# EasyEDA Pro project all_pcb.eprj

# Schematic Schematic1
Board Name: 前置差分放大; Create Date: 2024-09-15
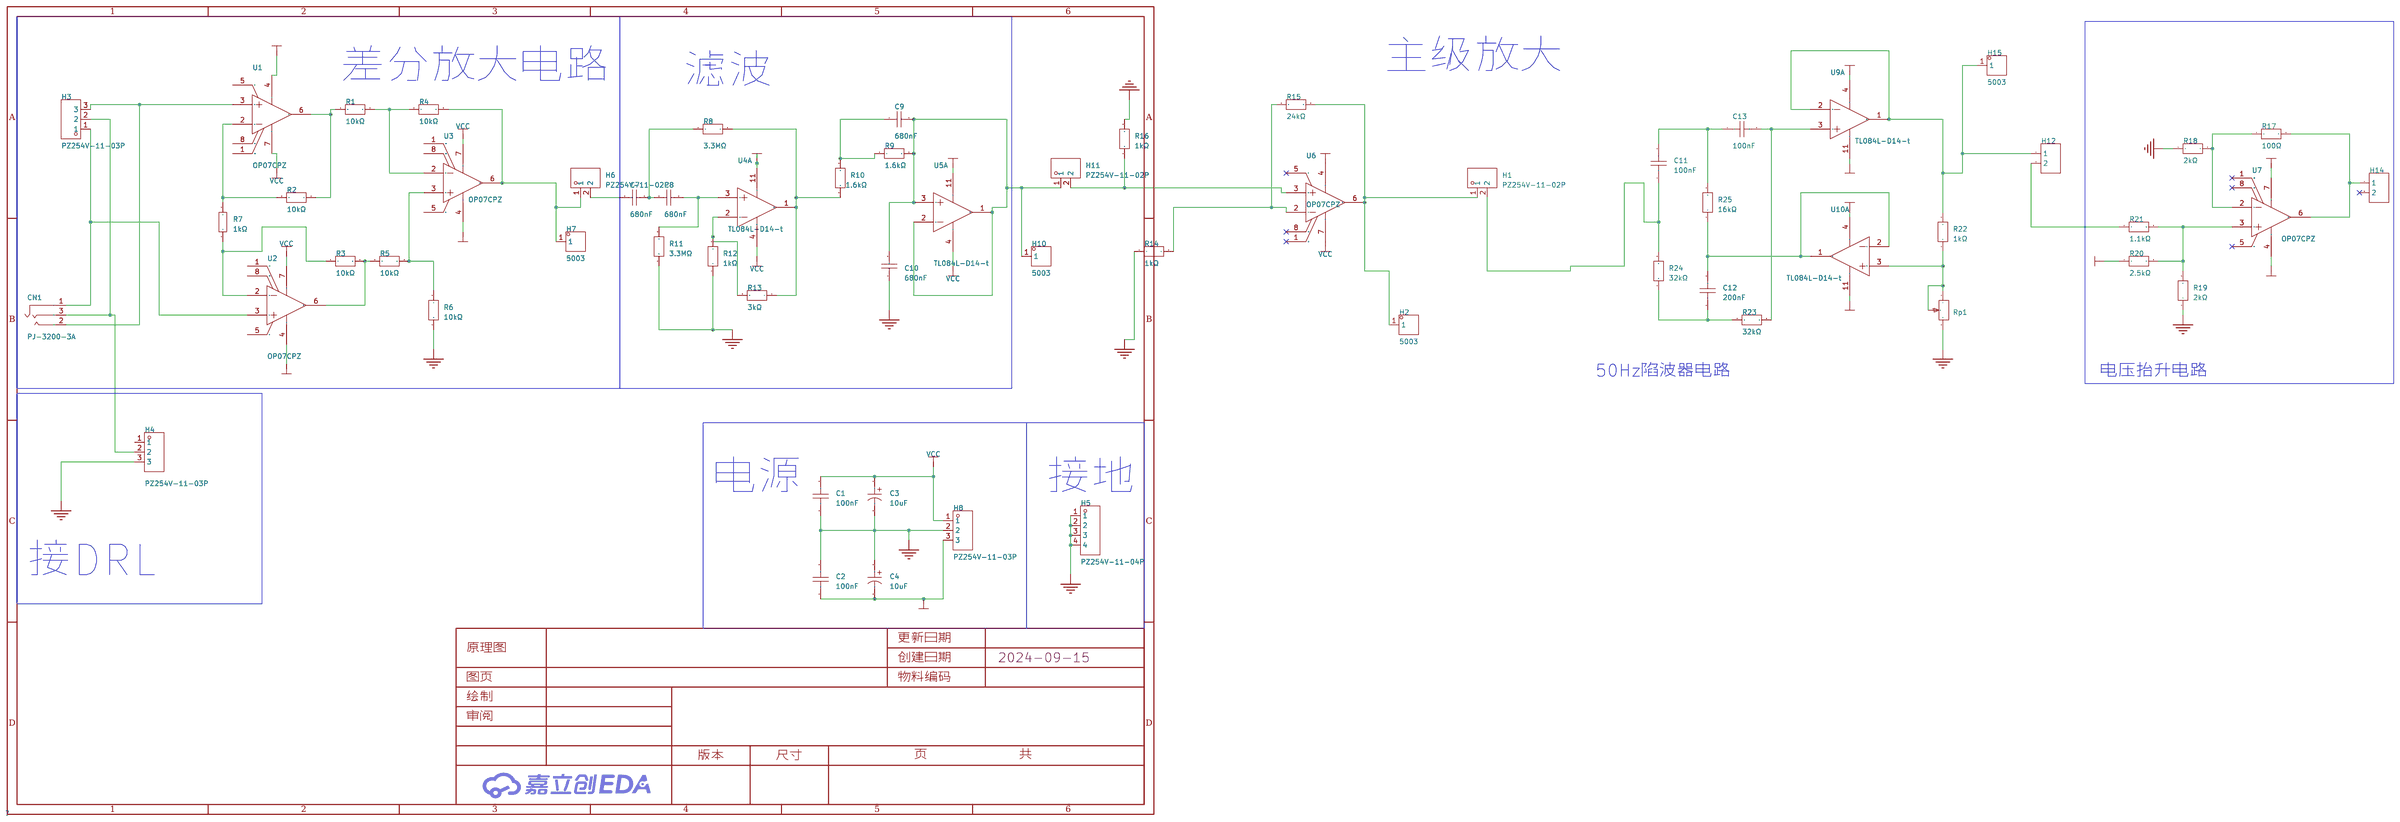
[diagram p0: schematic sheet]

## Parts
C1  100nF  [CAP-TH_L13.0-W6.0-P10.0-D0.6]
C2  100nF  [CAP-TH_L13.0-W6.0-P10.0-D0.6]
C3  10uF  [CAP-TH_BD10.0-P5.00-D0.6-FD]
C4  10uF  [CAP-TH_BD10.0-P5.00-D0.6-FD]
C7  680nF  [CAP-TH_L7.5-W6.5-P5.00-D0.5]
C8  680nF  [CAP-TH_L7.5-W6.5-P5.00-D0.5]
C9  680nF  [CAP-TH_L7.5-W6.5-P5.00-D0.5]
C10  680nF  [CAP-TH_L7.5-W6.5-P5.00-D0.5]
C11  100nF  [CAP-TH_L5.1-W3.8-P5.08-D1.2]
C12  200nF  [CAP-TH_L18.0-W8.0-P15.00-D0.8]
C13  100nF  [CAP-TH_L5.1-W3.8-P5.08-D1.2]
CN1  PJ-3200-3A  [AUDIO-TH_PJ-3200-3A]
H1  PZ254V-11-02P  [HDR-TH_2P-P2.54-V-M]
H2  5003  [TEST-TH_BD2.54-P1.39]
H3  PZ254V-11-03P  [HDR-TH_3P-P2.54-V-M]
H4  PZ254V-11-03P  [HDR-TH_3P-P2.54-V-M]
H5  PZ254V-11-04P  [HDR-TH_4P-P2.54-V-M]
H6  PZ254V-11-02P  [HDR-TH_2P-P2.54-V-M]
H7  5003  [TEST-TH_BD2.54-P1.39]
H8  PZ254V-11-03P  [HDR-TH_3P-P2.54-V-M]
H10  5003  [TEST-TH_BD2.54-P1.39]
H11  PZ254V-11-02P  [HDR-TH_2P-P2.54-V-M]
H12  -  [HDR-TH_2P-P2.54-V-F]
H14  -  [HDR-TH_2P-P2.54-V-F]
H15  5003  [TEST-TH_BD2.54-P1.39]
R1  10kΩ  [RES-TH_BD2.4-L6.3-P10.30-D0.6]
R2  10kΩ  [RES-TH_BD2.4-L6.3-P10.30-D0.6]
R3  10kΩ  [RES-TH_BD2.4-L6.3-P10.30-D0.6]
R4  10kΩ  [RES-TH_BD2.4-L6.3-P10.30-D0.6]
R5  10kΩ  [RES-TH_BD2.4-L6.3-P10.30-D0.6]
R6  10kΩ  [RES-TH_BD2.4-L6.3-P10.30-D0.6]
R7  1kΩ  [RES-TH_BD2.5-L6.5-P10.50-D0.6]
R8  3.3MΩ  [RES-TH_BD2.4-L6.3-P10.30-D0.6]
R9  1.6kΩ  [RES-TH_BD2.4-L6.3-P10.30-D0.6]
R10  1.6kΩ  [RES-TH_BD2.4-L6.3-P10.30-D0.6]
R11  3.3MΩ  [RES-TH_BD2.4-L6.3-P10.30-D0.6]
R12  1kΩ  [RES-TH_BD2.4-L6.3-P10.30-D0.6]
R13  3kΩ  [RES-TH_BD2.4-L6.3-P10.30-D0.6]
R14  1kΩ  [RES-TH_BD2.4-L6.3-P10.30-D0.6]
R15  24kΩ  [RES-TH_BD2.4-L6.3-P10.30-D0.6]
R16  1kΩ  [RES-TH_BD2.4-L6.3-P10.30-D0.6]
R17  100Ω  [RES-TH_BD3.7-L10.0-P15.00-D0.6]
R18  2kΩ  [RES-TH_BD2.3-L6.5-P10.50-D0.5]
R19  2kΩ  [RES-TH_BD2.3-L6.5-P10.50-D0.5]
R20  2.5kΩ  [RES-TH_BD4.6-L11.4-P15.40-D0.8]
R21  1.1kΩ  [RES-TH_BD3.3-L9.0-P13.00-D0.6]
R22  1kΩ  [RES-TH_BD2.3-L6.5-P10.50-D0.5]
R23  32kΩ  [RES-TH_BD2.4-L6.5-P10.50-D0.5]
R24  32kΩ  [RES-TH_BD2.4-L6.5-P10.50-D0.5]
R25  16kΩ  [RES-TH_BD3.3-L9.0-P13.00-D0.6]
Rp1  -  [RES-ADJ-TH_3296W]
U1  OP07CPZ  [PDIP-8_L9.3-W6.4-P2.54-LS7.6-BL]
U2  OP07CPZ  [PDIP-8_L9.3-W6.4-P2.54-LS7.6-BL]
U3  OP07CPZ  [PDIP-8_L9.3-W6.4-P2.54-LS7.6-BL]
U4  TL084L-D14-t  [PDIP-14_L19.3-W6.5-P2.54-LS7.6-BL]  (section 1)
U5  TL084L-D14-t  [PDIP-14_L19.3-W6.5-P2.54-LS7.6-BL]  (section 1)
U6  OP07CPZ  [PDIP-8_L9.3-W6.4-P2.54-LS7.6-BL]
U7  OP07CPZ  [PDIP-8_L9.3-W6.4-P2.54-LS7.6-BL]
U9  TL084L-D14-t  [PDIP-14_L19.3-W6.5-P2.54-LS7.6-BL]  (section 1)
U10  TL084L-D14-t  [PDIP-14_L19.3-W6.5-P2.54-LS7.6-BL]  (section 1)

## Library data of the parts
C1 C2 = 1X2H410K275-11: LCSC Part Name: 等级:X2 100nF ±10% 275V; Supplier Part: C2846731; Manufacturer: BM(丰明电容); Supplier Footprint: 插件,P=10mm; JLCPCB Part Class: 扩展库; Datasheet: https://atta.szlcsc.com/upload/public/pdf/source/20210728/C2846732_DAC16FCBF90FAF4BF667A23B36E0C6E8.pdf; Supplier: LCSC; Tolerance: ±10%; Voltage(AC): 275V; Subclass: X2
C3 C4 = UCS2E100MPD1TD: LCSC Part Name: 10uF ±20% 250V; Supplier Part: C1579721; Manufacturer: Nichicon(尼吉康); Supplier Footprint: 插件; JLCPCB Part Class: 扩展库; Datasheet: https://atta.szlcsc.com/upload/public/pdf/source/20211009/4F4CA769B8C92F768087E64A1413DB40.pdf; Supplier: LCSC; Tolerance: ±20%; Rated Voltage: 250V; Ripple Current: 175mA@120Hz; Lead Spacing: 5mm; φD: 10mm; Lifetime @ Temp: 8000hrs@105℃; Operating Temperature: -40℃~+105℃
C7-C10 = PE684J2A0502: 容值:680nF;精度:±5%;额定电压:100V;工作温度:-40℃~+110℃;; LCSC Part Name: 680nF ±5% 100V; Supplier Part: C478437; Manufacturer: KYET(科雅); Supplier Footprint: 插件,P=5mm; JLCPCB Part Class: 扩展库; Datasheet: https://atta.szlcsc.com/upload/public/pdf/source/20200102/C478437_80764A5A52068CAA3BEDED5BEA089104.pdf; Supplier: LCSC; Tolerance: ±5%; Voltage Rated: 100V; Operating Temperature: -40℃~+110℃
C11 C13 = C322C104KBR5TA: 容值:100nF;精度:±10%;额定电压:630V;温度系数:X7R;; LCSC Part Name: 100nF ±10% 630V; Supplier Part: C129685; Manufacturer: KEMET(基美); Supplier Footprint: 插件,P=5.08mm; JLCPCB Part Class: 扩展库; Datasheet: https://atta.szlcsc.com/upload/public/pdf/source/20180502/C129685_22A0E9A1A89AC8F69AAACD1F3AA6AB03.pdf; Supplier: LCSC; Tolerance: ±10%; Voltage Rated: 630V; Temperature Coefficient: X7R
C12 = B32922H3204M: 容值:200nF;精度:±20%;电压(AC):305V;等级:X2;; LCSC Part Name: 等级:X2 200nF ±20% 305V; Supplier Part: C3298878; Manufacturer: TDK; Supplier Footprint: 插件,P=15mm; JLCPCB Part Class: 扩展库; Datasheet: https://atta.szlcsc.com/upload/public/pdf/source/20240403/6B857094AE2B4215483F52CB5BD16209.pdf; Supplier: LCSC; Tolerance: ±20%; Voltage(AC): 305V; Subclass: X2; Operating Temperature: -40℃~+110℃
CN1 = PJ-3200-3A: LCSC Part Name: 3.5mm耳机座; Supplier Part: C709202; Manufacturer: 韩国韩荣; Supplier Footprint: 插件; JLCPCB Part Class: 扩展库; Datasheet: https://atta.szlcsc.com/upload/public/pdf/source/20201012/C709202_4DD47C61DF91E6337EB1570AC409C882.pdf; Supplier: LCSC; Connector Type: 3.5mm耳机座; Current Rating (Max): 500mA; Voltage Rating (Max): 30V; Operating Temperature Range: -20℃~+70℃
H1 H6 H11 = PZ254V-11-02P: LCSC Part Name: 间距:2.54mm 1x2P 直插 方针; Supplier Part: C492401; Manufacturer: XFCN(兴飞); Supplier Footprint: 插件,P=2.54mm; JLCPCB Part Class: 扩展库; Datasheet: https://atta.szlcsc.com/upload/public/pdf/source/20200309/C492401_A812433581A9B211A7FFA413ADDFF0E5.pdf; Supplier: LCSC; Pin Structure: 1x2P; Pitch: 2.54mm; Circluar Pins/Square Pins: 方针; Mounting Type: 直插; Number of Rows: 单排; Number of Pins: 2P; Length of Mating Pin: 6mm; Insulation Height: 2.5mm; Length of End Connection Pin: 3mm; Contact Material: 黄铜; Operating Temperature Range: -40℃~+105℃; Color: 黑色
H2 H7 H10 H15 = 5003: Supplier Part: C238124; Manufacturer: Keystone; Datasheet: https://atta.szlcsc.com/upload/public/pdf/source/20211115/64B944F8418AA2CF0680BB1B201435FB.pdf; Supplier: LCSC; Type: 测试环; Overall Length/Height: 7.62mm; Contact Material: 磷青铜
H3 H4 H8 = PZ254V-11-03P: LCSC Part Name: 间距:2.54mm 1x3P 直插 方针; Supplier Part: C2937625; Manufacturer: XFCN(兴飞); Supplier Footprint: 插件,P=2.54mm; JLCPCB Part Class: 扩展库; Datasheet: https://atta.szlcsc.com/upload/public/pdf/source/20200309/C492402_8335C3D49C4E4C618838D59BB1D024C1.pdf; Supplier: LCSC; Pin Structure: 1x3P; Pitch: 2.54mm; Circluar Pins/Square Pins: 方针; Mounting Type: 直插; Number of Rows: 单排; Number of Pins: 3P; Current Rating (Max): 3A; Voltage Rating (Max): 250V; Length of Mating Pin: 6mm; Insulation Height: 2.5mm; Length of End Connection Pin: 3mm; Operating Temperature Range: -40℃~+105℃; Color: 黑色
H5 = PZ254V-11-04P: LCSC Part Name: 间距:2.54mm 1x4P 直插 方针; Supplier Part: C2691448; Manufacturer: XFCN(兴飞); Supplier Footprint: 插件,P=2.54mm; JLCPCB Part Class: 扩展库; Datasheet: https://atta.szlcsc.com/upload/public/pdf/source/20200309/C492403_F9F19131791D08044AD4F84F8E751A34.pdf; Supplier: LCSC; Pin Structure: 1x4P; Pitch: 2.54mm; Circluar Pins/Square Pins: 方针; Mounting Type: 直插; Number of Rows: 单排; Number of Pins: 4P; Current Rating (Max): 3A; Voltage Rating (Max): 250V; Length of Mating Pin: 6mm; Insulation Height: 2.5mm; Length of End Connection Pin: 3mm; Operating Temperature Range: -40℃~+105℃; Color: 黑色
H12 H14 = HDR-F_2.54_1x2P: Supplier Part: C49661; Supplier Footprint: 插件
R1-R6 R8-R16 = RN1/4W10KFT/BA1: LCSC Part Name: 10kΩ ±1% 250mW 金属膜电阻; Supplier Part: C410695; Manufacturer: Tyohm(幸亚电阻); Supplier Footprint: 插件,D2.4xL6.5mm; JLCPCB Part Class: 扩展库; Datasheet: https://atta.szlcsc.com/upload/public/pdf/source/20190808/C410699_D126E64D28B638F1D73B58E9F61DFD9B.pdf; Supplier: LCSC; Type: 金属膜电阻; Tolerance: ±1%; Overload Voltage (Max): 250V; Power(Watts): 250mW; Temperature Coefficient: ±50ppm/℃; Operating Temperature Range: -55℃~+125℃
R7 = MFR0W4F1001A50: LCSC Part Name: 1kΩ ±1% 250mW 金属膜电阻; Supplier Part: C57435; Manufacturer: UNI-ROYAL(厚声); Supplier Footprint: 插件,D2.2xL6.5mm; JLCPCB Part Class: 扩展库; Datasheet: https://atta.szlcsc.com/upload/public/pdf/source/20191012/C436293_8820AA14BC71FA35E551C06C441482A0.pdf; Supplier: LCSC; Type: 金属膜电阻; Tolerance: ±1%; Overload Voltage (Max): 250V; Power(Watts): 250mW; Temperature Coefficient: ±50ppm/℃
R17 = MMFR3710B100RV9: 电阻类型:金属膜电阻;阻值:100Ω;精度:±0.1%;功率:500mW;温度系数:±5ppm/℃;; LCSC Part Name: 金属膜电阻 100Ω ±0.1% 500mW; Supplier Part: C7603277; Manufacturer: RESI(开步睿思); Supplier Footprint: 插件,D3.7xL10mm; Datasheet: https://atta.szlcsc.com/upload/public/pdf/source/20230906/5CDEB36B20538353A7DCF0119D7D7003.pdf; Supplier: LCSC; Type: 金属膜电阻; Tolerance: ±0.1%; Overload Voltage (Max): 300V; Power(Watts): 500mW; Temperature Coefficient: ±5ppm/℃; Operating Temperature Range: -55℃~+125℃
R18 R19 = MF1/4W-2KΩ±1%T52: 电阻类型:金属膜电阻;阻值:2kΩ;精度:±1%;功率:250mW;温度系数:±200ppm/℃;; LCSC Part Name: 金属膜电阻 2kΩ ±1% 250mW; Supplier Part: C714001; Manufacturer: 华星机电; Supplier Footprint: 插件,D2.3xL6.5mm; JLCPCB Part Class: 扩展库; Datasheet: https://atta.szlcsc.com/upload/public/pdf/source/20200731/C713882_AE8EB1102749D7E4FB4FB13DC898C429.pdf; Supplier: LCSC; Type: 金属膜电阻; Tolerance: ±1%; Power(Watts): 250mW; Temperature Coefficient: ±200ppm/℃
R20 = WHC2K5FET: 电阻类型:绕线电阻;阻值:2.5kΩ;精度:±1%;功率:2W;温度系数:±20ppm/℃;; LCSC Part Name: 绕线电阻 2.5kΩ ±1% 2W; Supplier Part: C3505401; Manufacturer: Ohmite; Supplier Footprint: 插件,D4.6xL11.4mm; JLCPCB Part Class: 扩展库; Datasheet: https://atta.szlcsc.com/upload/public/pdf/source/20210417/087EAD1F647A2CF587132FB7AFBF5B0A.pdf; Supplier: LCSC; Type: 绕线电阻; Tolerance: ±1%; Power(Watts): 2W; Temperature Coefficient: ±20ppm/℃; Operating Temperature Range: -55℃~+150℃
R21 = RSF-50JR-52-1K1: 电阻类型:金属膜电阻;阻值:1.1kΩ;精度:±5%;功率:500mW;温度系数:±300ppm/℃;; LCSC Part Name: 金属膜电阻 1.1kΩ ±5% 500mW; Supplier Part: C1752465; Manufacturer: YAGEO(国巨); Supplier Footprint: 插件,D3.3xL9mm; JLCPCB Part Class: 扩展库; Datasheet: https://atta.szlcsc.com/upload/public/pdf/source/20200722/C705062_59B157870D59CA0881ABA296A8644ADF.pdf; Supplier: LCSC; Type: 金属膜电阻; Tolerance: ±5%; Power(Watts): 500mW; Temperature Coefficient: ±300ppm/℃; Operating Temperature Range: -55℃~+155℃
R22 = MF1/4W-5.1KΩ±1%T52: 电阻类型:金属膜电阻;阻值:5.1kΩ;精度:±1%;功率:250mW;温度系数:±200ppm/℃;; LCSC Part Name: 金属膜电阻 5.1kΩ ±1% 250mW; Supplier Part: C714010; Manufacturer: 华星机电; Supplier Footprint: 插件,D2.3xL6.5mm; Datasheet: https://atta.szlcsc.com/upload/public/pdf/source/20200731/C713882_AE8EB1102749D7E4FB4FB13DC898C429.pdf; Supplier: LCSC; Type: 金属膜电阻; Tolerance: ±1%; Power(Watts): 250mW; Temperature Coefficient: ±200ppm/℃
R23 R24 = RNF14BTE32K0: 电阻类型:金属膜电阻;阻值:32kΩ;精度:±0.1%;功率:250mW;温度系数:±25ppm/℃;; LCSC Part Name: 金属膜电阻 32kΩ ±0.1% 250mW; Supplier Part: C2592661; Manufacturer: SEI(Stackpole Electronics Inc.); Supplier Footprint: 插件,D2.4xL6.4mm; JLCPCB Part Class: 扩展库; Datasheet: https://atta.szlcsc.com/upload/public/pdf/source/20210416/CE3C3DFE1F0E2A8D22EC743938724C43.pdf; Supplier: LCSC; Type: 金属膜电阻; Tolerance: ±0.1%; Power(Watts): 250mW; Temperature Coefficient: ±25ppm/℃; Operating Temperature Range: -55℃~+155℃
R25 = RSF-50JT-52-16K: 电阻类型:金属膜电阻;阻值:16kΩ;精度:±5%;功率:500mW;温度系数:±300ppm/℃;; LCSC Part Name: 金属膜电阻 16kΩ ±5% 500mW; Supplier Part: C1377696; Manufacturer: YAGEO(国巨); Supplier Footprint: 插件,D3.3xL9mm; JLCPCB Part Class: 扩展库; Datasheet: https://atta.szlcsc.com/upload/public/pdf/source/20200722/C705062_59B157870D59CA0881ABA296A8644ADF.pdf; Supplier: LCSC; Type: 金属膜电阻; Tolerance: ±5%; Power(Watts): 500mW; Temperature Coefficient: ±300ppm/℃; Operating Temperature Range: -55℃~+155℃
Rp1 = 精密电位器 3296W/50欧姆: 阻值:-;功率:-;; LCSC Part Name: 50Ω; Supplier Part: C21881; Supplier Footprint: VR-3296W; JLCPCB Part Class: 扩展库; Supplier: LCSC
U1-U3 U6 U7 = OP07CPZ: Supplier Part: C408829; Manufacturer: ADI(亚德诺); Supplier Footprint: PDIP-8; JLCPCB Part Class: 扩展库; Datasheet: https://atta.szlcsc.com/upload/public/pdf/source/20190807/C408829_BE0F3A08CC30F779D7ED20D5AC7364F9.pdf; Supplier: LCSC
U4 U5 U9 U10 = TL084L-D14-t: Supplier Part: C7509603; Manufacturer: UTC(友顺); Supplier Footprint: DIP-14; JLCPCB Part Class: 扩展库; Datasheet: https://atta.szlcsc.com/upload/public/pdf/source/20230825/21103CE5C41335A2FDBC1DDE797A8A69.pdf; Supplier: LCSC

## Nets
GND: C1.1 C2.2 C3.2 C4.1 C10.1 H4.3 H5.1 H5.2 H5.3 H5.4 H8.2 R6.1 R11.1 R12.1 R14.1 R16.2 R18.1 R19.1 Rp1.3
VCC: C1.2 C3.1 H8.1 R20.1 U1.7(V+) U2.7(V+) U3.7(V+) U4.4(V+) U5.4(V+) U6.7(V+) U7.7(V+) U9.4(V+) U10.4(V+)
VEE: C2.1 C4.2 H8.3 U1.4(V-) U2.4(V-) U3.4(V-) U4.11(V-) U5.11(V-) U6.4(V-) U7.4(V-) U9.11(V-) U10.11(V-)
$1N1148: CN1.2 H3.3 U1.3(IN+)
$1N1174: R3.1 R7.1 U2.2(IN-)
$1N1182: CN1.1 H3.1 U2.3(IN+)
$1N1311: R2.2 R7.2 U1.2(IN-)
$1N1319: R1.1 R2.1 U1.6(OUT)
$1N1379: R3.2 R5.1 U2.6(OUT)
$1N1397: R1.2 R4.1 U3.2(IN-)
$1N1420: R5.2 R6.2 U3.3(IN+)
$1N1452: H6.1 H7.1 R4.2 U3.6(OUT)
$1N2211: CN1.3 H3.2 H4.2
$1N4885: C7.2 C8.1 R8.1
$1N4886: C8.2 R11.2 U4.3(IN1+)
$1N4888: R12.2 R13.2 U4.2(IN1-)
$1N4890: R8.2 R10.1 R13.1 U4.1(OUT1)
$1N4893: C9.1 R9.1 R10.2
$1N5273: C7.1 H6.2
$1N6829: R14.2 R15.1 U6.2(IN-)
$1N6834: H11.2 R16.1 U6.3(IN+)
$1N8038: H1.1 H2.1 R15.2 U6.6(OUT)
$1N8751: C11.1 H1.2 R24.2
$1N9817: R22.1 Rp1.1 Rp1.2 U10.3(IN1+)
$1N9823: C12.2 R25.1 U10.1(OUT1) U10.2(IN1-)
$1N9824: H12.1 H15.1 R22.2 U9.1(OUT1) U9.2(IN1-)
$1N9825: C13.2 R23.2 U9.3(IN1+)
$1N9827: C12.1 R23.1 R24.1
$1N9828: C11.2 C13.1 R25.2
$1N9831: R19.2 R20.2 R21.2 U7.3(IN+)
$1N9832: H12.2 R21.1
$1N9836: R17.1 R18.2 U7.2(IN-)
$1N9837: H14.1 R17.2 U7.6(OUT)
$1N15205: C9.2 C10.2 H10.1 H11.1 R9.2 U5.1(OUT1) U5.2(IN1-) U5.3(IN1+)

Not connected (* = marked no-connect by the designer): H4 1; H14 2*; U1 1(VOS_TRIM) 5(NC) 8(VOS_TRIM); U2 1(VOS_TRIM) 5(NC) 8(VOS_TRIM); U3 1(VOS_TRIM) 5(NC) 8(VOS_TRIM); U6 1(VOS_TRIM)* 5(NC)* 8(VOS_TRIM)*; U7 1(VOS_TRIM)* 5(NC)* 8(VOS_TRIM)*

## Notes on the sheet
- 主级放大
- 差分放大电路
- 滤波
- 50Hz陷波器电路
- 电压抬升电路
- 电源
- 接地
- 接DRL

# Board PCB1
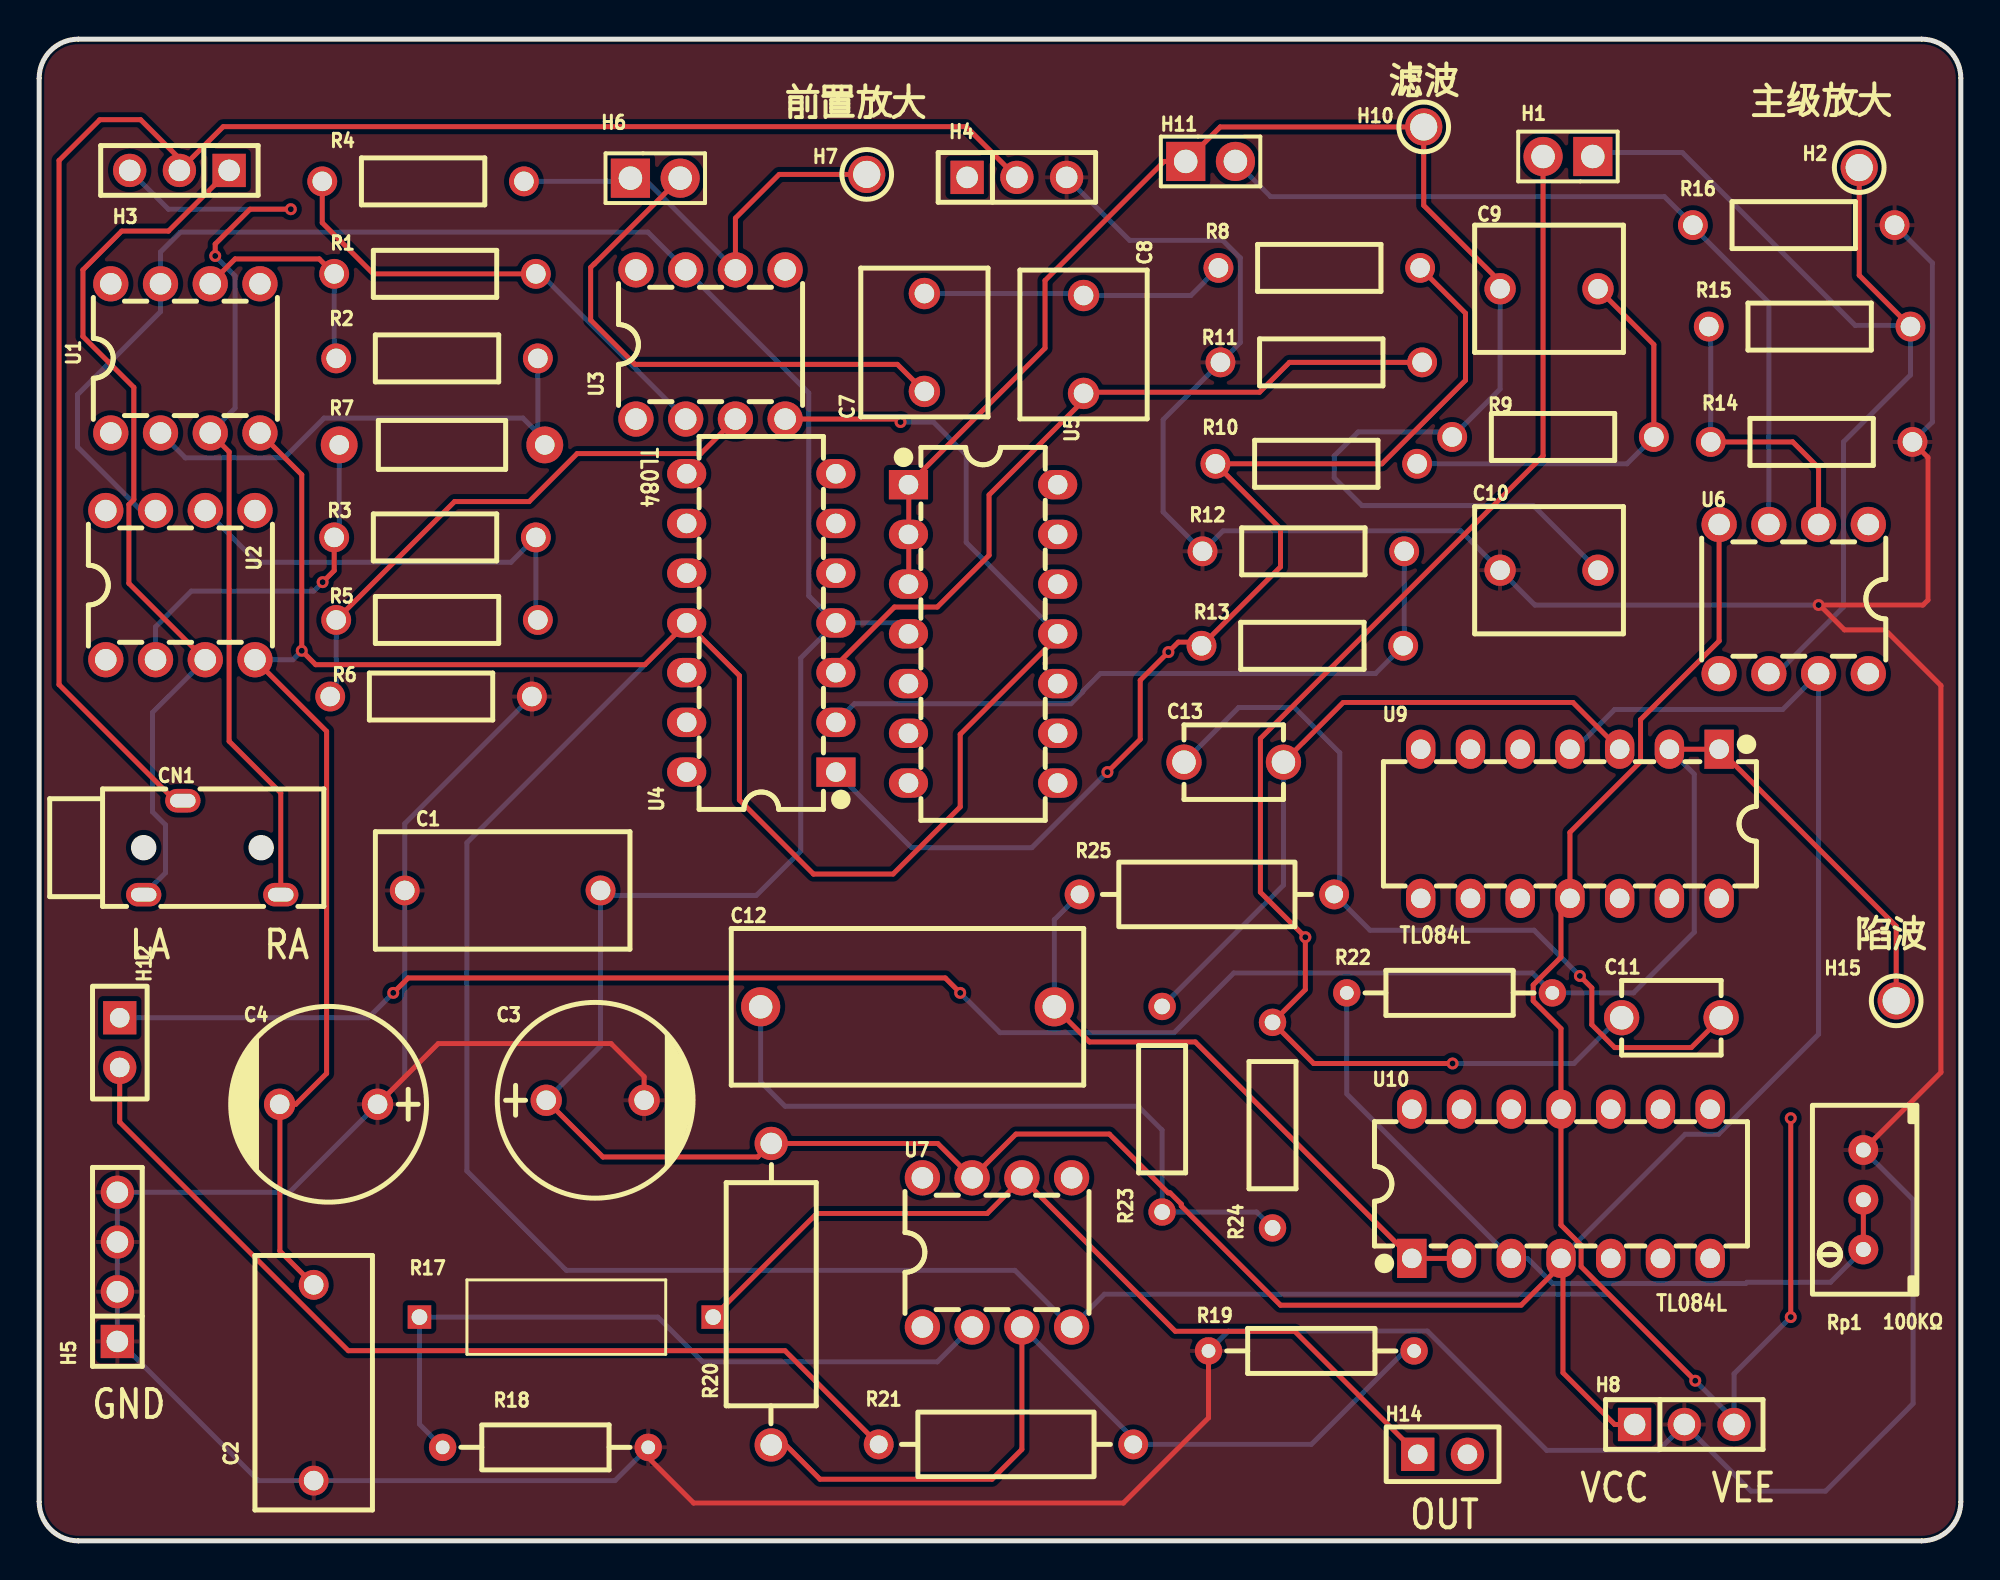
[diagram p1: board, top side]
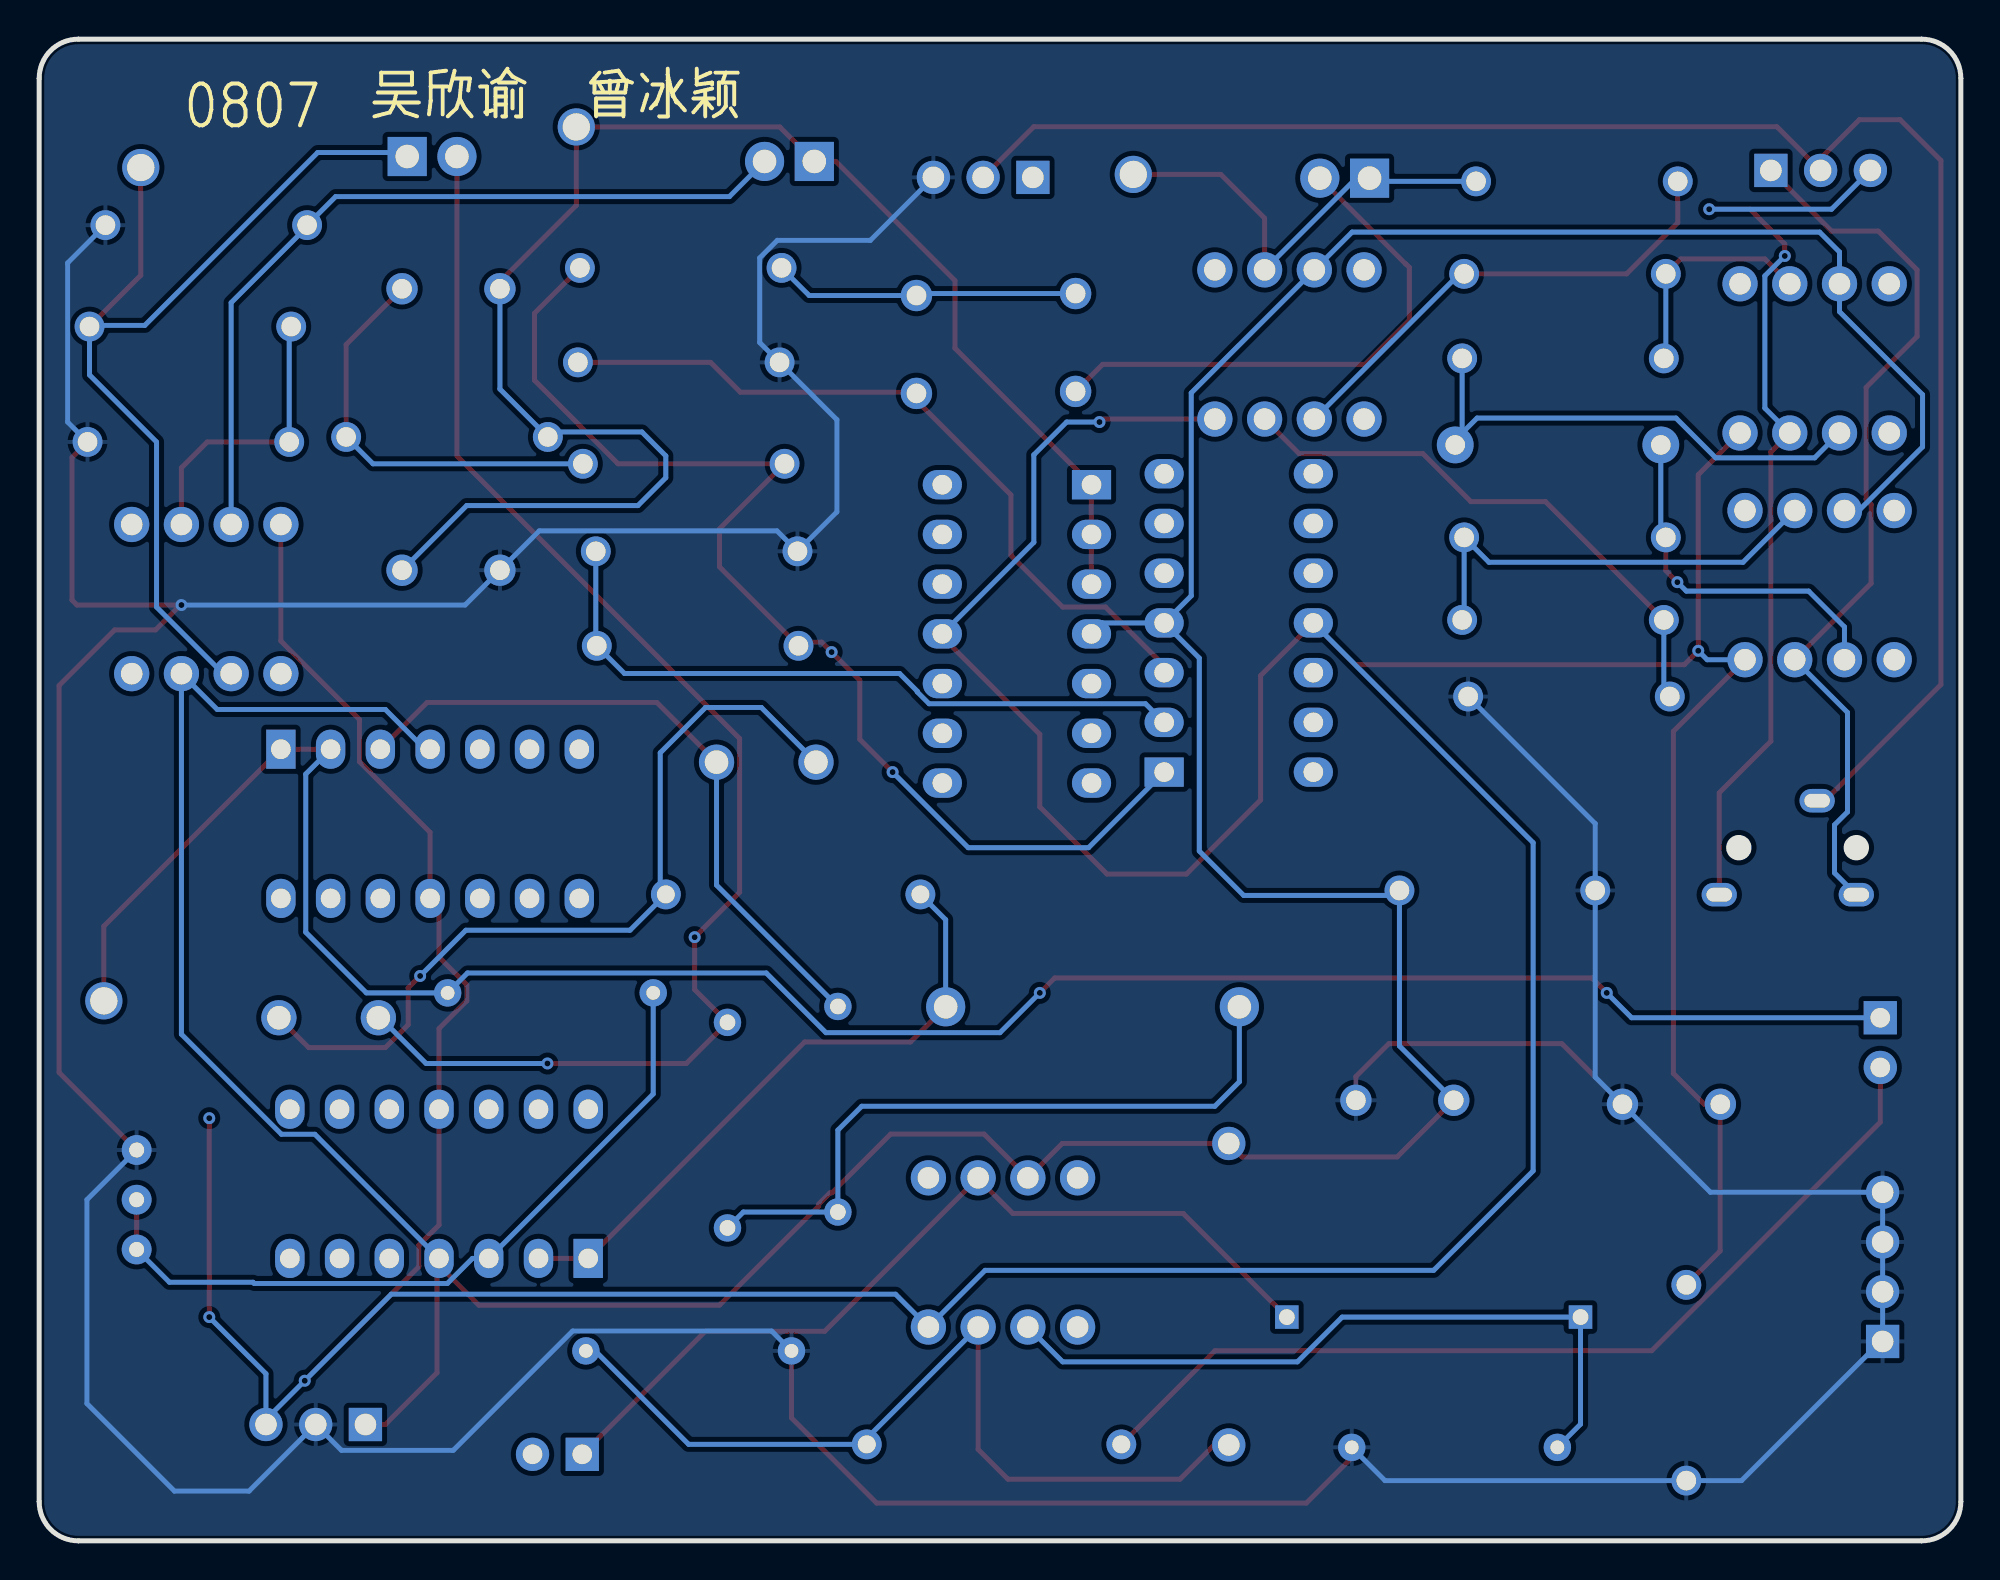
[diagram p2: board, bottom side, seen from below]

Outline 98.15 x 76.71 mm; copper layers: Top Layer, Bottom Layer. Coordinates in mm from the lower left corner of the outline.
Outline path: 0,74.71 0,2 arc(0.59,0.59) 2,0 96.15,0 arc(97.56,0.59) 98.15,2 98.15,74.71 arc(97.56,76.12) 96.15,76.71 2,76.71 arc(0.59,76.12) 0,74.71
Stack: Top Layer 0.035mm / Dielectric1 1.51mm FR4 er 4.5 / Bottom Layer 0.035mm

## Design rules (mm)
template: JLCPCB Capability(Two Layers Board)
spacing copperThickness1oz (default): track to track 0.102, other pairs 0.152 to 0.3
spacing copperThickness2oz: track to track 0.203, other pairs 0.152 to 0.3
track width copperThickness1oz (default): min 0.127, default 0.254, max 2.54
track width copperThickness2oz: min 0.203, default 0.254, max 2.54
differential pair differentialPair (default): width min 0.127, default 0.254, max 2.54; gap min 0.152, default 0.152
via viaSize (default): diameter min 0.5, default 0.61, max 10; hole min 0.3, default 0.305, max 6.3

## Placement (name value [footprint] x y rotation side)
C1  100nF  [CAP-TH_L13.0-W6.0-P10.0-D0.6]  23.67 33.22 0 top
C2  100nF  [CAP-TH_L13.0-W6.0-P10.0-D0.6]  14.02 8.08 270 top
C3  10uF  [CAP-TH_BD10.0-P5.00-D0.6-FD]  28.4 22.5 0 top
C4  10uF  [CAP-TH_BD10.0-P5.00-D0.6-FD]  14.78 22.3 180 top
C7  680nF  [CAP-TH_L7.5-W6.5-P5.00-D0.5]  45.21 61.21 90 top
C8  680nF  [CAP-TH_L7.5-W6.5-P5.00-D0.5]  53.34 61.11 270 top
C9  680nF  [CAP-TH_L7.5-W6.5-P5.00-D0.5]  77.11 63.96 180 top
C10  680nF  [CAP-TH_L7.5-W6.5-P5.00-D0.5]  77.11 49.58 0 top
C11  100nF  [CAP-TH_L5.1-W3.8-P5.08-D1.2]  83.36 26.72 0 top
C12  200nF  [CAP-TH_L18.0-W8.0-P15.00-D0.8]  44.35 27.28 0 top
C13  100nF  [CAP-TH_L5.1-W3.8-P5.08-D1.2]  61.01 39.78 0 top
CN1  PJ-3200-3A  [AUDIO-TH_PJ-3200-3A]  8.84 35.41 0 top
H1  PZ254V-11-02P  [HDR-TH_2P-P2.54-V-M]  78.08 70.71 180 top
H2  5003  [TEST-TH_BD2.54-P1.39]  92.96 70.15 0 top
H3  PZ254V-11-03P  [HDR-TH_3P-P2.54-V-M]  7.16 70 180 top
H4  PZ254V-11-03P  [HDR-TH_3P-P2.54-V-M]  49.94 69.65 0 top
H5  PZ254V-11-04P  [HDR-TH_4P-P2.54-V-M]  4 14 90 top
H6  PZ254V-11-02P  [HDR-TH_2P-P2.54-V-M]  31.47 69.61 0 top
H7  5003  [TEST-TH_BD2.54-P1.39]  42.27 69.8 90 top
H8  PZ254V-11-03P  [HDR-TH_3P-P2.54-V-M]  84.02 5.94 0 top
H10  5003  [TEST-TH_BD2.54-P1.39]  70.71 72.22 0 top
H11  PZ254V-11-02P  [HDR-TH_2P-P2.54-V-M]  59.83 70.46 0 top
H12  -  [HDR-TH_2P-P2.54-V-F]  4.11 25.45 270 top
H14  -  [HDR-TH_2P-P2.54-V-F]  71.68 4.42 0 top
H15  5003  [TEST-TH_BD2.54-P1.39]  94.84 27.58 0 top
R1  10kΩ  [RES-TH_BD2.4-L6.3-P10.30-D0.6]  20.22 64.72 0 top
R2  10kΩ  [RES-TH_BD2.4-L6.3-P10.30-D0.6]  20.32 60.4 0 top
R3  10kΩ  [RES-TH_BD2.4-L6.3-P10.30-D0.6]  20.22 51.26 0 top
R4  10kΩ  [RES-TH_BD2.4-L6.3-P10.30-D0.6]  19.61 69.44 0 top
R5  10kΩ  [RES-TH_BD2.4-L6.3-P10.30-D0.6]  20.32 47.04 180 top
R6  10kΩ  [RES-TH_BD2.4-L6.3-P10.30-D0.6]  20.02 43.13 180 top
R7  1kΩ  [RES-TH_BD2.5-L6.5-P10.50-D0.6]  20.57 55.98 0 top
R8  3.3MΩ  [RES-TH_BD2.4-L6.3-P10.30-D0.6]  65.38 65.02 0 top
R9  1.6kΩ  [RES-TH_BD2.4-L6.3-P10.30-D0.6]  77.32 56.39 180 top
R10  1.6kΩ  [RES-TH_BD2.4-L6.3-P10.30-D0.6]  65.23 55.02 0 top
R11  3.3MΩ  [RES-TH_BD2.4-L6.3-P10.30-D0.6]  65.48 60.2 0 top
R12  1kΩ  [RES-TH_BD2.4-L6.3-P10.30-D0.6]  64.57 50.55 0 top
R13  3kΩ  [RES-TH_BD2.4-L6.3-P10.30-D0.6]  64.52 45.72 0 top
R14  1kΩ  [RES-TH_BD2.4-L6.3-P10.30-D0.6]  90.53 56.13 180 top
R15  24kΩ  [RES-TH_BD2.4-L6.3-P10.30-D0.6]  90.42 62.03 0 top
R16  1kΩ  [RES-TH_BD2.4-L6.3-P10.30-D0.6]  89.61 67.21 0 top
R17  100Ω  [RES-TH_BD3.7-L10.0-P15.00-D0.6]  26.92 11.43 0 top
R18  2kΩ  [RES-TH_BD2.3-L6.5-P10.50-D0.5]  25.86 4.78 180 top
R19  2kΩ  [RES-TH_BD2.3-L6.5-P10.50-D0.5]  64.97 9.7 0 top
R20  2.5kΩ  [RES-TH_BD4.6-L11.4-P15.40-D0.8]  37.39 12.6 270 top
R21  1.1kΩ  [RES-TH_BD3.3-L9.0-P13.00-D0.6]  49.38 4.93 0 top
R22  1kΩ  [RES-TH_BD2.3-L6.5-P10.50-D0.5]  72.03 27.99 0 top
R23  32kΩ  [RES-TH_BD2.4-L6.5-P10.50-D0.5]  57.35 22.05 90 top
R24  32kΩ  [RES-TH_BD2.4-L6.5-P10.50-D0.5]  62.99 21.23 90 top
R25  16kΩ  [RES-TH_BD3.3-L9.0-P13.00-D0.6]  59.64 33.02 0 top
Rp1  -  [RES-ADJ-TH_3296W]  93.17 17.42 180 top
U1  OP07CPZ  [PDIP-8_L9.3-W6.4-P2.54-LS7.6-BL]  7.47 60.4 0 top
U2  OP07CPZ  [PDIP-8_L9.3-W6.4-P2.54-LS7.6-BL]  7.21 48.82 0 top
U3  OP07CPZ  [PDIP-8_L9.3-W6.4-P2.54-LS7.6-BL]  34.29 61.11 0 top
U4  TL084L-D14-t  [PDIP-14_L19.3-W6.5-P2.54-LS7.6-BL]  36.88 46.89 90 top
U5  TL084L-D14-t  [PDIP-14_L19.3-W6.5-P2.54-LS7.6-BL]  48.21 46.33 270 top
U6  OP07CPZ  [PDIP-8_L9.3-W6.4-P2.54-LS7.6-BL]  89.61 48.11 180 top
U7  OP07CPZ  [PDIP-8_L9.3-W6.4-P2.54-LS7.6-BL]  48.92 14.73 0 top
U9  TL084L-D14-t  [PDIP-14_L19.3-W6.5-P2.54-LS7.6-BL]  78.18 36.63 180 top
U10  TL084L-D14-t  [PDIP-14_L19.3-W6.5-P2.54-LS7.6-BL]  77.72 18.24 0 top

## Footprints (pads in the part's own frame, mm; a bottom-side part is the same pattern mirrored in y, then rotated)
AUDIO-TH_PJ-3200-3A
  oval 1.8x1.2 hole 1.3x0.7: 1(-3.5,-2.4) 2(3.5,-2.4) 3(-1.5,2.4)
CAP-TH_BD10.0-P5.00-D0.6-FD
  round 1.6 hole 1: 1(-2.5,0) 2(2.5,0)
CAP-TH_L5.1-W3.8-P5.08-D1.2
  round 1.8 hole 1.2: 1(-2.54,0) 2(2.54,0)
CAP-TH_L7.5-W6.5-P5.00-D0.5
  round 1.6 hole 1: 1(-2.5,0) 2(2.5,0)
CAP-TH_L13.0-W6.0-P10.0-D0.6
  round 1.524 hole 1: 1(-5,0) 2(5,0)
CAP-TH_L18.0-W8.0-P15.00-D0.8
  round 2 hole 1.2: 1(-7.5,0) 2(7.5,0)
HDR-TH_2P-P2.54-V-F
  rect 1.7x1.7 hole 1: 1(-1.27,0)
  round 1.7 hole 1: 2(1.27,0)
HDR-TH_2P-P2.54-V-M
  rect 2x2 hole 1.2: 1(-1.27,0)
  round 2 hole 1.2: 2(1.27,0)
HDR-TH_3P-P2.54-V-M
  rect 1.7x1.7 hole 1.1: 1(-2.54,0)
  round 1.7 hole 1.1: 2(0,0) 3(2.54,0)
HDR-TH_4P-P2.54-V-M
  rect 1.7x1.7 hole 1.1: 1(-3.81,0)
  round 1.7 hole 1.1: 2(-1.27,0) 3(1.27,0) 4(3.81,0)
PDIP-8_L9.3-W6.4-P2.54-LS7.6-BL
  round 1.8 hole 1.1: 1(-3.81,-3.81) 2(-1.27,-3.81) 3(1.27,-3.81) 4(3.81,-3.81) 5(3.81,3.81) 6(1.27,3.81) 7(-1.27,3.81) 8(-3.81,3.81)
PDIP-14_L19.3-W6.5-P2.54-LS7.6-BL
  rect 1.5x2 hole 1: 1(-7.62,-3.81)
  oval 1.5x2 hole 1: 2(-5.08,-3.81) 3(-2.54,-3.81) 4(0,-3.81) 5(2.54,-3.81) 6(5.08,-3.81) 7(7.62,-3.81) 8(7.62,3.81) 9(5.08,3.81) 10(2.54,3.81) 11(0,3.81) 12(-2.54,3.81) 13(-5.08,3.81) 14(-7.62,3.81)
RES-ADJ-TH_3296W
  round 1.524 hole 0.762: 1(0,2.54) 2(0,0) 3(0,-2.54)
RES-TH_BD2.3-L6.5-P10.50-D0.5
  round 1.4 hole 0.7: 1(-5.25,0) 2(5.25,0)
RES-TH_BD2.4-L6.3-P10.30-D0.6
  round 1.524 hole 1: 1(-5.15,0) 2(5.15,0)
RES-TH_BD2.4-L6.5-P10.50-D0.5
  round 1.4 hole 0.8: 1(-5.25,0) 2(5.25,0)
RES-TH_BD2.5-L6.5-P10.50-D0.6
  round 1.879 hole 1: 1(-5.25,0) 2(5.25,0)
RES-TH_BD3.3-L9.0-P13.00-D0.6
  round 1.524 hole 0.914: 1(-6.5,0) 2(6.5,0)
RES-TH_BD3.7-L10.0-P15.00-D0.6
  rect 1.2x1.2 hole 0.8: 1(-7.5,0) 2(7.5,0)
RES-TH_BD4.6-L11.4-P15.40-D0.8
  round 1.7 hole 1.1: 1(-7.7,0) 2(7.7,0)
TEST-TH_BD2.54-P1.39
  round 1.9 hole 1.39: 1(0,0)

## Nets
As in the schematic.

Pads without a net: H4 1; H14 2; U1 1 5 8; U2 1 5 8; U3 1 5 8; U4 5 6 7 8 9 10 12 13 14; U5 5 6 7 8 9 10 12 13 14; U6 1 5 8; U7 1 5 8; U9 5 6 7 8 9 10 12 13 14; U10 5 6 7 8 9 10 12 13 14

## Via types
v1: diameter 0.61, hole 0.305, Top Layer to Bottom Layer, 16 vias

## Routing (per net, layer and track width the routed paths; a pad name or vN(x,y) marks a point on that pad's centre or on a via; arc(x,y) is an arc through that point)
GND: length 307.7
  Top Layer w0.254: C4.1 20.38,25.4 29.21,25.4 30.9,23.71 C3.2 ; v1(90.88,47.8) 90.93,47.8 ; 90.93,47.8 92.2,46.53 94.28,46.53 97.13,43.69 97.13,23.93 93.17,19.96 ; 90.93,47.8 96.21,47.8 96.47,48.06 96.47,55.34 R14.1 ; R18.1 31.11,4.25 33.43,1.93 55.37,1.93 59.72,6.28 R19.1
  Bottom Layer w0.254: 93.17,19.96 95.71,17.42 95.71,7.01 91.24,2.54 87.43,2.54 H8.2 82.7,4.62 76.99,4.62 70.9,10.72 60.74,10.72 R19.1 ; v1(90.88,47.8) 76.39,47.8 C10.1 72.6,51.59 60.46,51.59 R12.1 57.4,52.56 57.4,57.27 R11.1 61.35,61.21 61.35,65.53 60.45,66.43 55.69,66.43 52.48,69.65 ; R14.1 96.69,57.15 96.69,65.28 R16.2 ; R6.1 18.67,36.64 C1.1 18.67,23.69 C4.1 12.79,17.81 H5.4 H5.3 H5.2 H5.1 4.09,10.19 11.2,3.08 C2.2 29.41,3.08 R18.1
VCC: length 226.9
  Top Layer w0.254: C3.1 28.79,19.61 36.7,19.61 R20.1 45.89,20.3 U7.7 49.89,20.78 54.66,20.78 57.66,17.78 57.76,17.78 58.33,17.2 58.33,17.11 63.4,12.04 75.69,12.04 77.72,14.07 U10.4 77.83,14.33 77.83,8.59 80.47,5.94 H8.1
  Bottom Layer w0.254: U5.4 43.84,46.89 U4.4 ; U4.4 39.31,48.27 39.31,58.64 U3.7 31.09,66.85 7.21,66.85 6.2,65.84 U1.7 6.2,62.79 1.96,58.55 1.96,55.88 5.21,52.63 U2.7 ; U4.4 38.89,45.09 38.89,35.24 36.63,32.97 28.93,32.97 C1.2 28.67,25.28 C3.1 ; U9.4 78.44,40.44 80.47,42.47 89.05,42.47 U6.7 90.88,25.88 85.77,20.77 84.07,20.77 U10.4
VEE: length 299.4
  Top Layer w0.254: 12.29,22.3 12.29,14.8 C2.1 ; 12.29,22.3 C4.2 ; 12.29,22.3 13.11,22.3 14.68,23.88 14.68,41.35 U2.4 ; U6.4 85.8,45.97 81.79,41.95 81.79,39.8 78.18,36.19 U9.11 77.72,32.36 77.72,29.81 76.3,28.4 76.3,27.59 77.72,26.17 U10.11 77.72,16.13 78.75,15.1 78.75,14.01 v1(84.58,8.18) ; v1(43.99,57.15) 43.84,57.3 38.1,57.3 ; v1(89.46,11.43) v1(89.46,21.59) ; U5.11 52.02,46.18 47.04,41.2 47.04,37.49 43.61,34.06 39.55,34.06 35.76,37.85 35.76,44.2 U4.11 30.94,44.75 14.12,44.75 v1(13.41,45.47) 13.41,54.46 U1.4
  Bottom Layer w0.254: H8.3 86.56,6.2 ; 86.56,6.2 86.56,8.53 v1(89.46,11.43) ; 86.56,6.2 v1(84.58,8.18) 80.16,12.6 54.41,12.6 U7.4 49.83,13.82 26.92,13.82 21.84,18.9 21.84,35.66 U4.11 ; U5.11 47.35,51 47.35,55.47 45.67,57.15 v1(43.99,57.15) ; U2.4 12.95,45.01 v1(13.41,45.47)
$1N1148: length 49.3
  Top Layer w0.254: v1(12.85,68.02) 10.77,68.02 8.99,66.24 v1(8.99,65.63) ; CN1.2 12.34,38.21 9.7,40.84 9.7,55.63 U1.3
  Bottom Layer w0.254: H3.3 6.6,68.02 v1(12.85,68.02) ; v1(8.99,65.63) 10.01,64.62 10.01,57.86 U1.3
$1N1174: length 18.5
  Top Layer w0.254: R3.1 15.07,49.56 v1(14.48,48.97)
  Bottom Layer w0.254: R3.1 15.32,51.51 R7.1 ; v1(14.48,48.97) 14.02,48.51 7.77,48.51 5.94,46.69 U2.2
$1N1182: length 46.1
  Top Layer w0.254: U2.3 4.58,48.91 4.58,52.94 4.84,53.19 4.84,58.92 2.23,61.52 2.23,64.92 4.22,66.9 6.6,66.9 H3.1
  Bottom Layer w0.254: CN1.1 6.45,34.12 6.45,36.57 5.79,37.23 5.79,42.31 U2.3
$1N1311: length 25.5
  Bottom Layer w0.254: R2.2 25.47,56.59 ; 25.47,56.59 25.47,56.34 25.82,55.98 ; 25.47,56.59 24.71,57.35 14.55,57.35 12.52,55.32 7.47,55.32 U1.2
$1N1319: length 11.5
  Top Layer w0.254: R1.1 14.31,65.48 10.01,65.48 U1.6
  Bottom Layer w0.254: R1.1 15.07,60.5 R2.1
$1N1379: length 22.8
  Bottom Layer w0.254: U2.6 11.12,49.99 24.1,49.99 R3.2 25.37,47.14 R5.1
$1N1397: length 24.8
  Top Layer w0.254: R4.1 14.46,67.33 17.07,64.72 R1.2
  Bottom Layer w0.254: 33.02,57.3 25.6,64.72 R1.2
$1N1420: length 28.7
  Top Layer w0.254: 35.56,57.3 33.8,55.54 27.48,55.54 25.02,53.09 21.22,53.09 R5.2
  Bottom Layer w0.254: R5.2 15.17,43.43 R6.2
$1N1452: length 23.1
  Top Layer w0.254: H7.1 37.8,69.8 35.56,67.56 U3.6
  Bottom Layer w0.254: R4.2 30.04,69.44 H6.1 30.88,69.61 U3.6
$1N2211: length 88.8
  Top Layer w0.254: H4.2 47.35,72.24 9.4,72.24 H3.2 7.16,70.61 5.18,72.59 3.1,72.59 1.02,70.51 1.02,43.74 6.95,37.81 CN1.3
$1N4885: length 15.6
  Bottom Layer w0.254: C7.2 53.24,63.71 C8.1 58.82,63.61 R8.1
$1N4886: length 38.7
  Top Layer w0.254: R11.2 63.86,60.2 62.33,58.67 53.4,58.67 C8.2 53.34,58.25 48.51,53.43 48.51,50.34 45.87,47.7 43.68,47.7 40.69,44.71 U4.3
$1N4888: length 35.5
  Bottom Layer w0.254: U4.2 41.64,42.76 52.7,42.76 53.3,43.36 53.3,43.4 54.2,44.31 68.25,44.31 R13.2 69.72,45.77 R12.2
$1N4890: length 60.2
  Top Layer w0.254: R8.2 72.85,62.71 72.85,59.28 68.58,55.02 R10.1 63.4,51.7 63.4,49.75 59.55,45.91 ; 59.55,45.91 58.18,45.91 v1(57.67,45.4) 56.24,43.96 56.24,40.94 v1(54.56,39.27) ; 59.55,45.91 R13.1
  Bottom Layer w0.254: U4.1 44.55,35.41 50.7,35.41 v1(54.56,39.27)
$1N4893: length 21.4
  Top Layer w0.254: R9.1 82.47,61.1 C9.1
  Bottom Layer w0.254: R10.2 81.1,55.02 R9.1
$1N5273: length 27.7
  Top Layer w0.254: H6.2 28.36,65.23 28.35,65.23 28.17,65.05 28.17,62.36 30.43,60.1 43.83,60.1 C7.1
$1N6829: length 14.9
  Top Layer w0.254: R14.2 89.56,56.13 90.88,54.81 U6.2
  Bottom Layer w0.254: R15.1 85.38,61.92 R14.2
$1N6834: length 41.6
  Bottom Layer w0.254: H11.2 62.89,68.67 83,68.67 R16.1 84.46,67.13 88.34,63.25 U6.3
$1N8038: length 50.2
  Top Layer w0.254: H2.1 92.96,64.64 R15.2
  Bottom Layer w0.254: H1.1 79.55,70.92 83.92,70.92 92.75,62.09 95.51,62.09 R15.2 95.57,59.56 92.15,56.13 92.15,47.7 88.75,44.3 U6.6
$1N8751: length 71.7
  Top Layer w0.254: H1.2 76.81,55.42 62.37,40.98 62.37,33.13 v1(64.67,30.84) 64.67,28.16 R24.2 65.09,24.38 v1(72.19,24.38)
  Bottom Layer w0.254: v1(72.19,24.38) 78.38,24.38 80.82,26.82 C11.1
$1N9817: length 38.8
  Top Layer w0.254: Rp1.2 Rp1.1
  Bottom Layer w0.254: R22.1 66.78,22.83 U10.3 76.02,14.43 77.3,13.15 87.16,13.15 87.22,13.21 91.49,13.21 Rp1.1
$1N9823: length 32.4
  Top Layer w0.254: U10.2 U10.1 59.05,25.48 53.64,25.48 C12.2
  Bottom Layer w0.254: C12.2 51.85,31.73 R25.1
$1N9824: length 114.4
  Top Layer w0.254: U9.2 U9.1 94.84,31.39 H15.1 ; v1(18.08,27.99) 18.85,28.75 46.28,28.75 v1(47.04,27.99)
  Bottom Layer w0.254: H12.1 16.81,26.72 v1(18.08,27.99) ; U9.2 84.53,39.17 84.53,31.09 81.43,27.99 R22.2 76.27,29.01 61.01,29.01 57.96,25.96 49.07,25.96 v1(47.04,27.99)
$1N9825: length 34.5
  Top Layer w0.254: U9.3 78.33,42.82 66.6,42.82 C13.2
  Bottom Layer w0.254: C13.2 63.55,33.49 R23.2
$1N9827: length 35.5
  Bottom Layer w0.254: C12.1 36.85,23.45 38.1,22.2 56.13,22.2 57.35,20.98 R23.1 62.18,16.8 R24.1
$1N9828: length 42.2
  Top Layer w0.254: v1(78.69,28.85) 79.3,28.24 79.3,26.37 80.47,25.2 84.38,25.2 C11.2
  Bottom Layer w0.254: 66.17,32.99 R25.2 ; 66.17,32.99 66.43,33.24 66.43,40.25 64.11,42.57 61.26,42.57 C13.1 ; 66.17,32.99 67.97,31.19 76.35,31.19 v1(78.69,28.85)
$1N9831: length 45
  Top Layer w0.254: R20.2 38.13,4.9 39.88,3.15 48.67,3.15 50.19,4.67 U7.3
  Bottom Layer w0.254: R21.2 64.97,4.93 69.75,9.7 R19.2 ; 56.03,5.08 U7.3
$1N9832: length 48.4
  Top Layer w0.254: H12.2 4.11,21.39 15.79,9.71 38.09,9.71 R21.1
$1N9836: length 37.1
  Bottom Layer w0.254: U7.2 45.87,9.14 33.88,9.14 31.6,11.43 19.42,11.43 19.42,5.96 R18.2
$1N9837: length 44.8
  Top Layer w0.254: 50.21,18.52 48.42,16.72 39.72,16.72 R17.2 ; 50.21,18.52 58.03,10.71 64.12,10.71 H14.1 ; 50.21,18.52 U7.6
$1N15205: length 82.7
  Top Layer w0.254: 44.41,51.42 U5.2 ; 44.41,51.42 44.41,48.88 U5.3 ; 44.41,51.42 44.41,53.96 ; C9.2 74.61,64.32 70.71,68.22 H10.1 60.32,72.22 H11.1 57.46,70.46 51.37,64.38 51.37,60.92 44.41,53.96 ; 44.41,53.96 U5.1
  Bottom Layer w0.254: C9.2 74.61,58.84 R9.2 71.91,56.64 67.36,56.64 66.14,55.42 66.14,54.31 67.56,52.88 76.31,52.88 C10.2

## Copper pours and planes (outline as drawn; the poured copper is in the pictures)
GND on Top Layer: -1.32,77.52 99.01,77.52 99.01,-0.46 -1.32,-0.46
GND on Bottom Layer: -0.76,77.52 98.65,77.52 98.65,-0.81 -0.76,-0.81

## Text on the board
Bottom Silkscreen Layer: 0807 | 吴欣谕  曾冰颖
Top Silkscreen Layer: 100KΩ | TL084 | TL084L | GND | LA | RA | OUT | VCC | VEE | 前置放大 | 滤波 | 主级放大 | 陷波
